# Altium schematic sheet LED.SchDoc
size A3; Organization: Altium Limited; Address1: L3, 12a Rodborough Rd; Address2: Frenchs Forest; Address3: NSW; Address4: Australia 2086
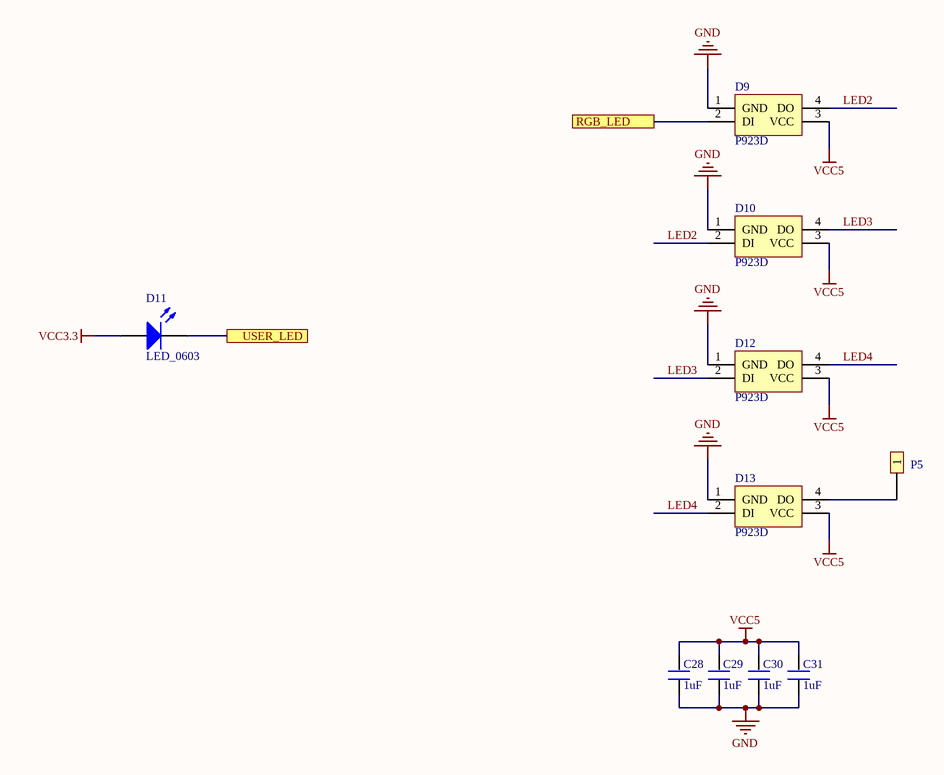
[diagram p0: LED.SchDoc]

## Parts
C28  1uF  [0603P]
C29  1uF  [0603P]
C30  1uF  [0603P]
C31  1uF  [0603P]
D9  P923D  [RGB_LED_5050]
D10  P923D  [RGB_LED_5050]
D11  LED_0603  [LED-0603]
D12  P923D  [RGB_LED_5050]
D13  P923D  [RGB_LED_5050]
P5  Header 1  [HEADER1]  (value not drawn)

## Ports
RGB_LED, USER_LED

## Nets
GND: C28.1 C29.1 C30.1 C31.1 D9.1(GND) D10.1(GND) D12.1(GND) D13.1(GND)
VCC3.3: D11.1
VCC5: C28.2 C29.2 C30.2 C31.2 D9.3(VCC) D10.3(VCC) D12.3(VCC) D13.3(VCC)
LED2: D9.4(DO) D10.2(DI)
LED3: D10.4(DO) D12.2(DI)
LED4: D12.4(DO) D13.2(DI)
RGB_LED: D9.2(DI) ; port RGB_LED
USER_LED: D11.2 ; port USER_LED
NetD13_4: D13.4(DO) P5.1

## Notes on the sheet
- Title
- Size:
- Date:
- A3
- Number:
- Time:
- Revision:
- Sheet
- of
- File:

## Library data of the parts
C28-C31 = C
D11 = LED 0603: 发光二极管; Published: 8-Jun-2000; LatestRevisionDate: 08-Jul-2005; LatestRevisionNote: Mech Layer 1 removed.; PackageReference: LED-0; Publisher: Altium Limited; PackageDescription: LED; 2 Leads
D9 D10 D12 D13 = P923D: Publisher: mazhongwei; Published: 8-August-2017; PackageReference: RGB_LED_5050
P5 = Header 1: LatestRevisionDate: 17-Jul-2002; LatestRevisionNote: Re-released for DXP Platform.; Publisher: Altium Limited